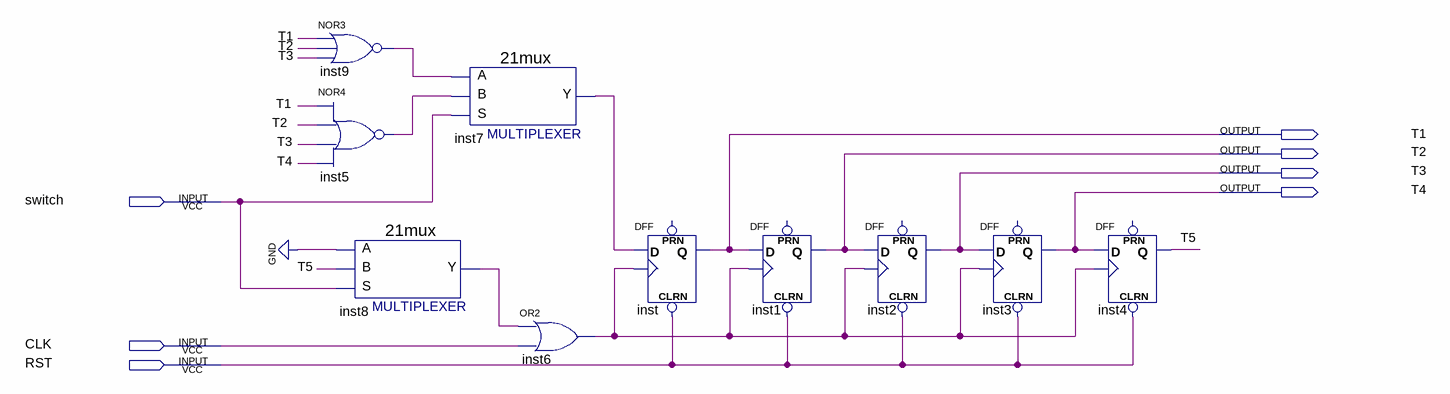
[diagram p0: schematic sheet]
// Quartus schematic test3.bdf as structural Verilog: 10 symbols, 7 pins
module test3 (
  input  switch,
  input  CLK,
  input  RST,
  output T1,
  output T2,
  output T3,
  output T4
);

  wire inst5_out, inst6_out, inst7_y, inst8_y, inst9_out, T5;

  nor inst9 (inst9_out, T1, T2, T3);
  nor inst5 (inst5_out, T1, T2, T3, T4);
  \21mux  inst8 (.S(switch), .B(T5), .A(1'b0), .Y(inst8_y));
  \21mux  inst7 (.S(switch), .B(inst5_out), .A(inst9_out), .Y(inst7_y));
  or inst6 (inst6_out, inst8_y, CLK);
  DFF inst (.CLRN(RST), .CLK(inst6_out), .D(inst7_y), .Q(T1));  // open: PRN
  DFF inst1 (.CLRN(RST), .CLK(inst6_out), .D(T1), .Q(T2));  // open: PRN
  DFF inst2 (.CLRN(RST), .CLK(inst6_out), .D(T2), .Q(T3));  // open: PRN
  DFF inst3 (.CLRN(RST), .CLK(inst6_out), .D(T3), .Q(T4));  // open: PRN
  DFF inst4 (.CLRN(RST), .CLK(inst6_out), .D(T4), .Q(T5));  // open: PRN
endmodule
